# EAGLE schematic StaticPlatformMain_v1 (EAGLE 9.6.2)
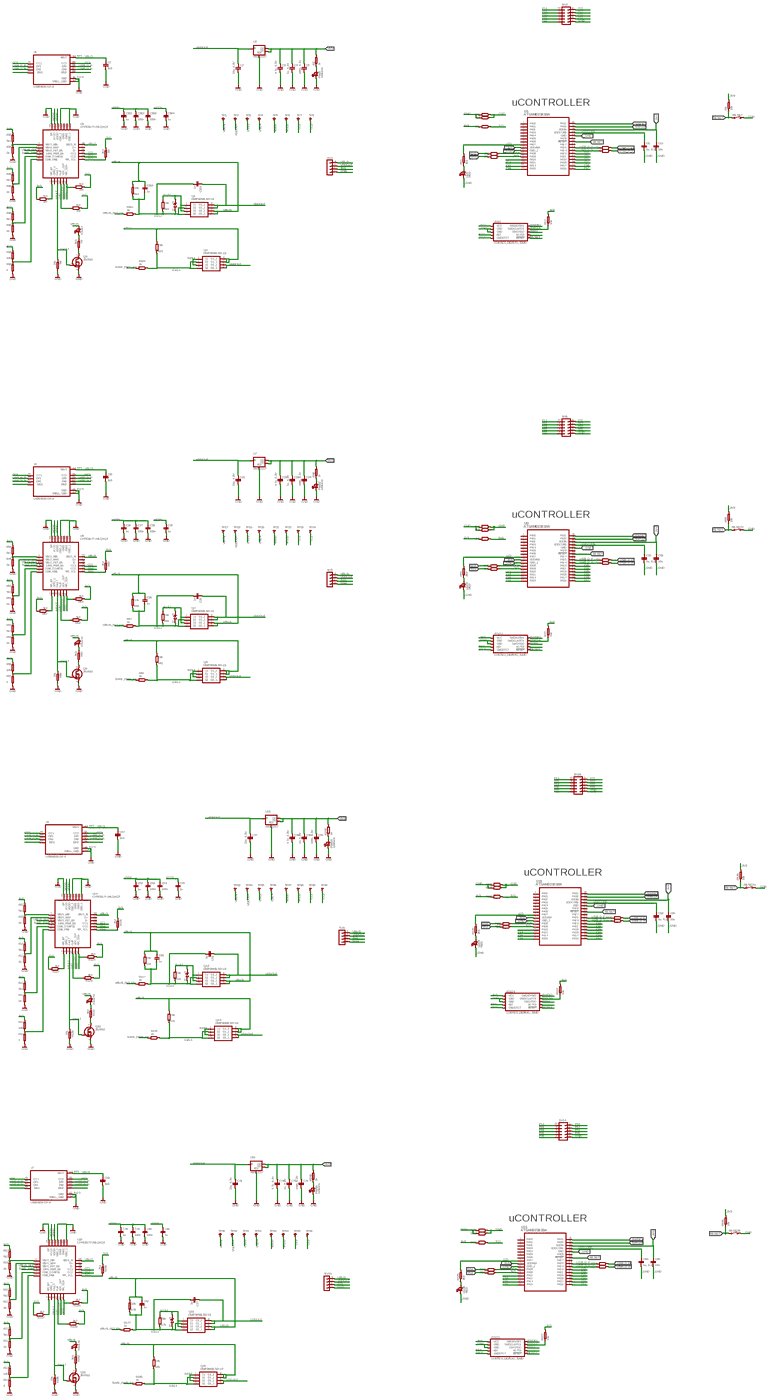
[diagram p0: schematic, sheet 1, overview]
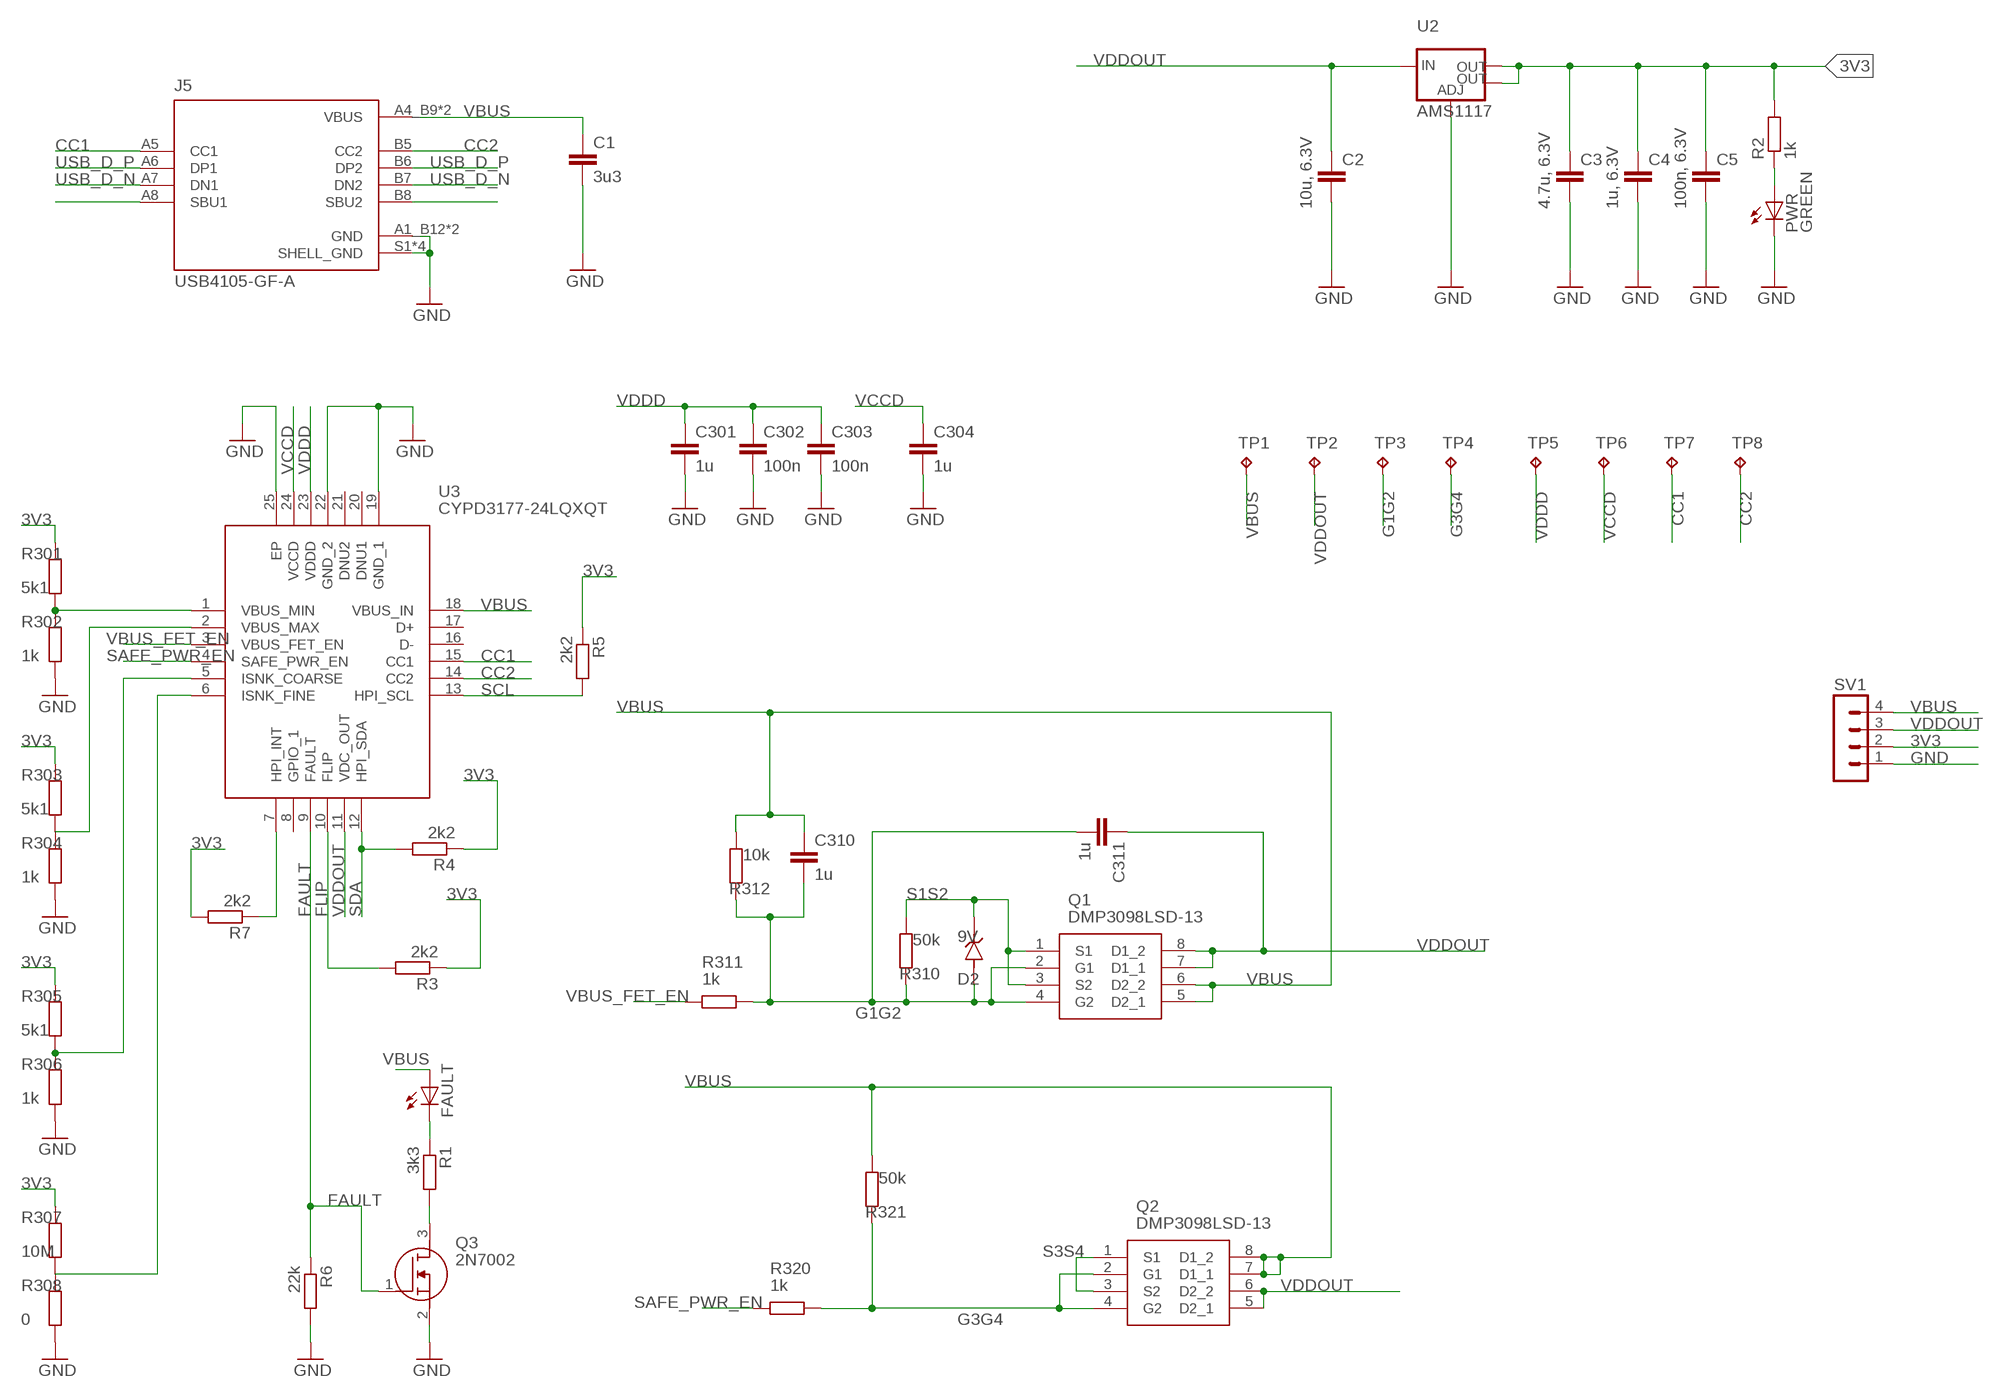
[diagram p1: schematic, sheet 1, part 1 of 6]
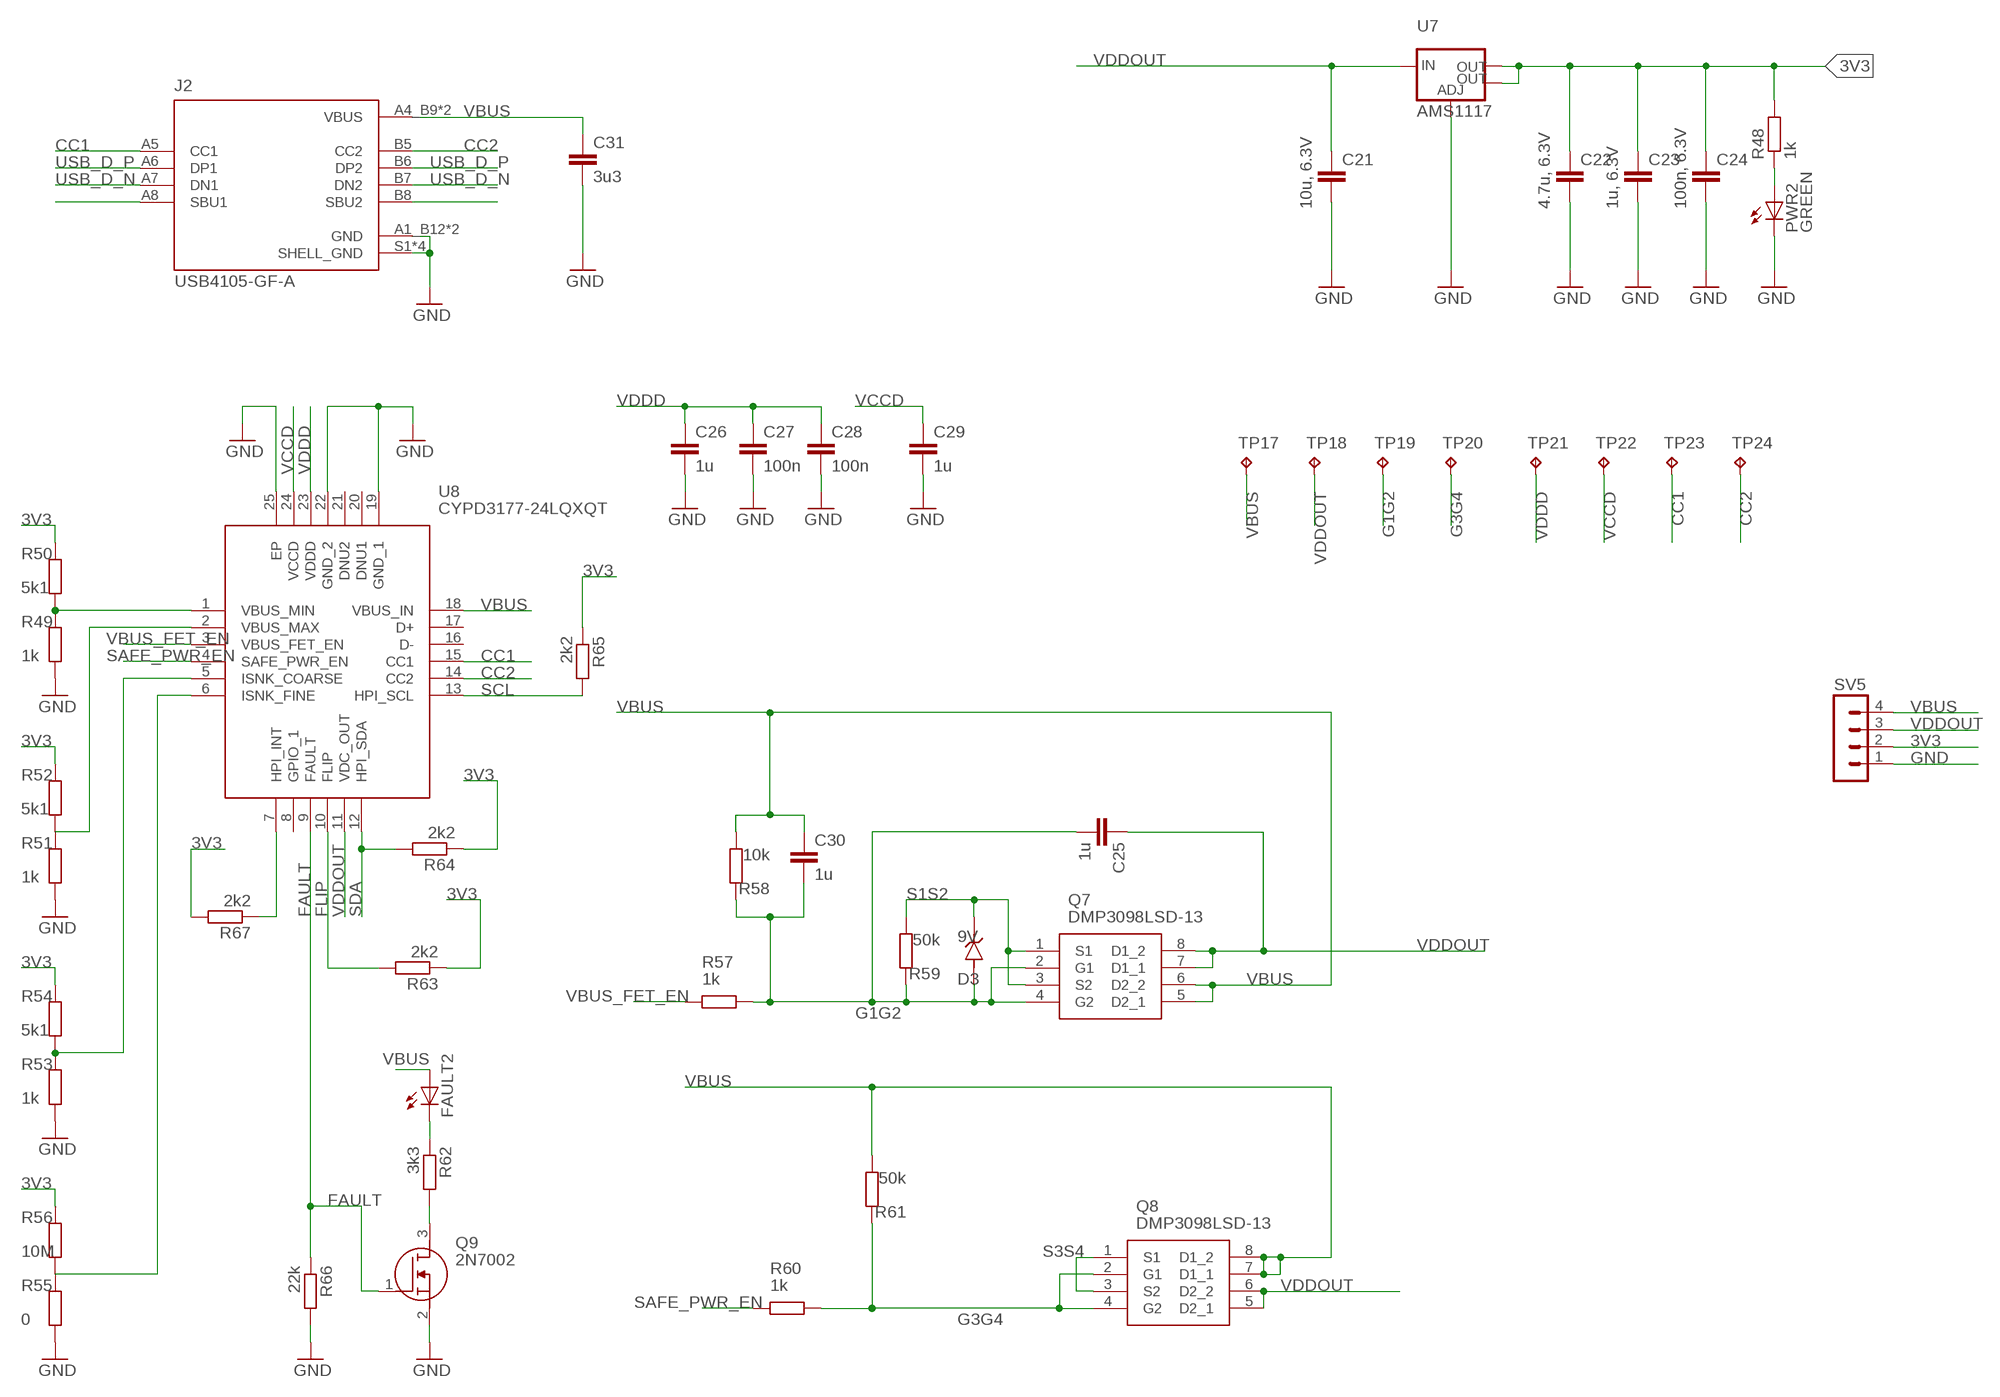
[diagram p2: schematic, sheet 1, part 2 of 6]
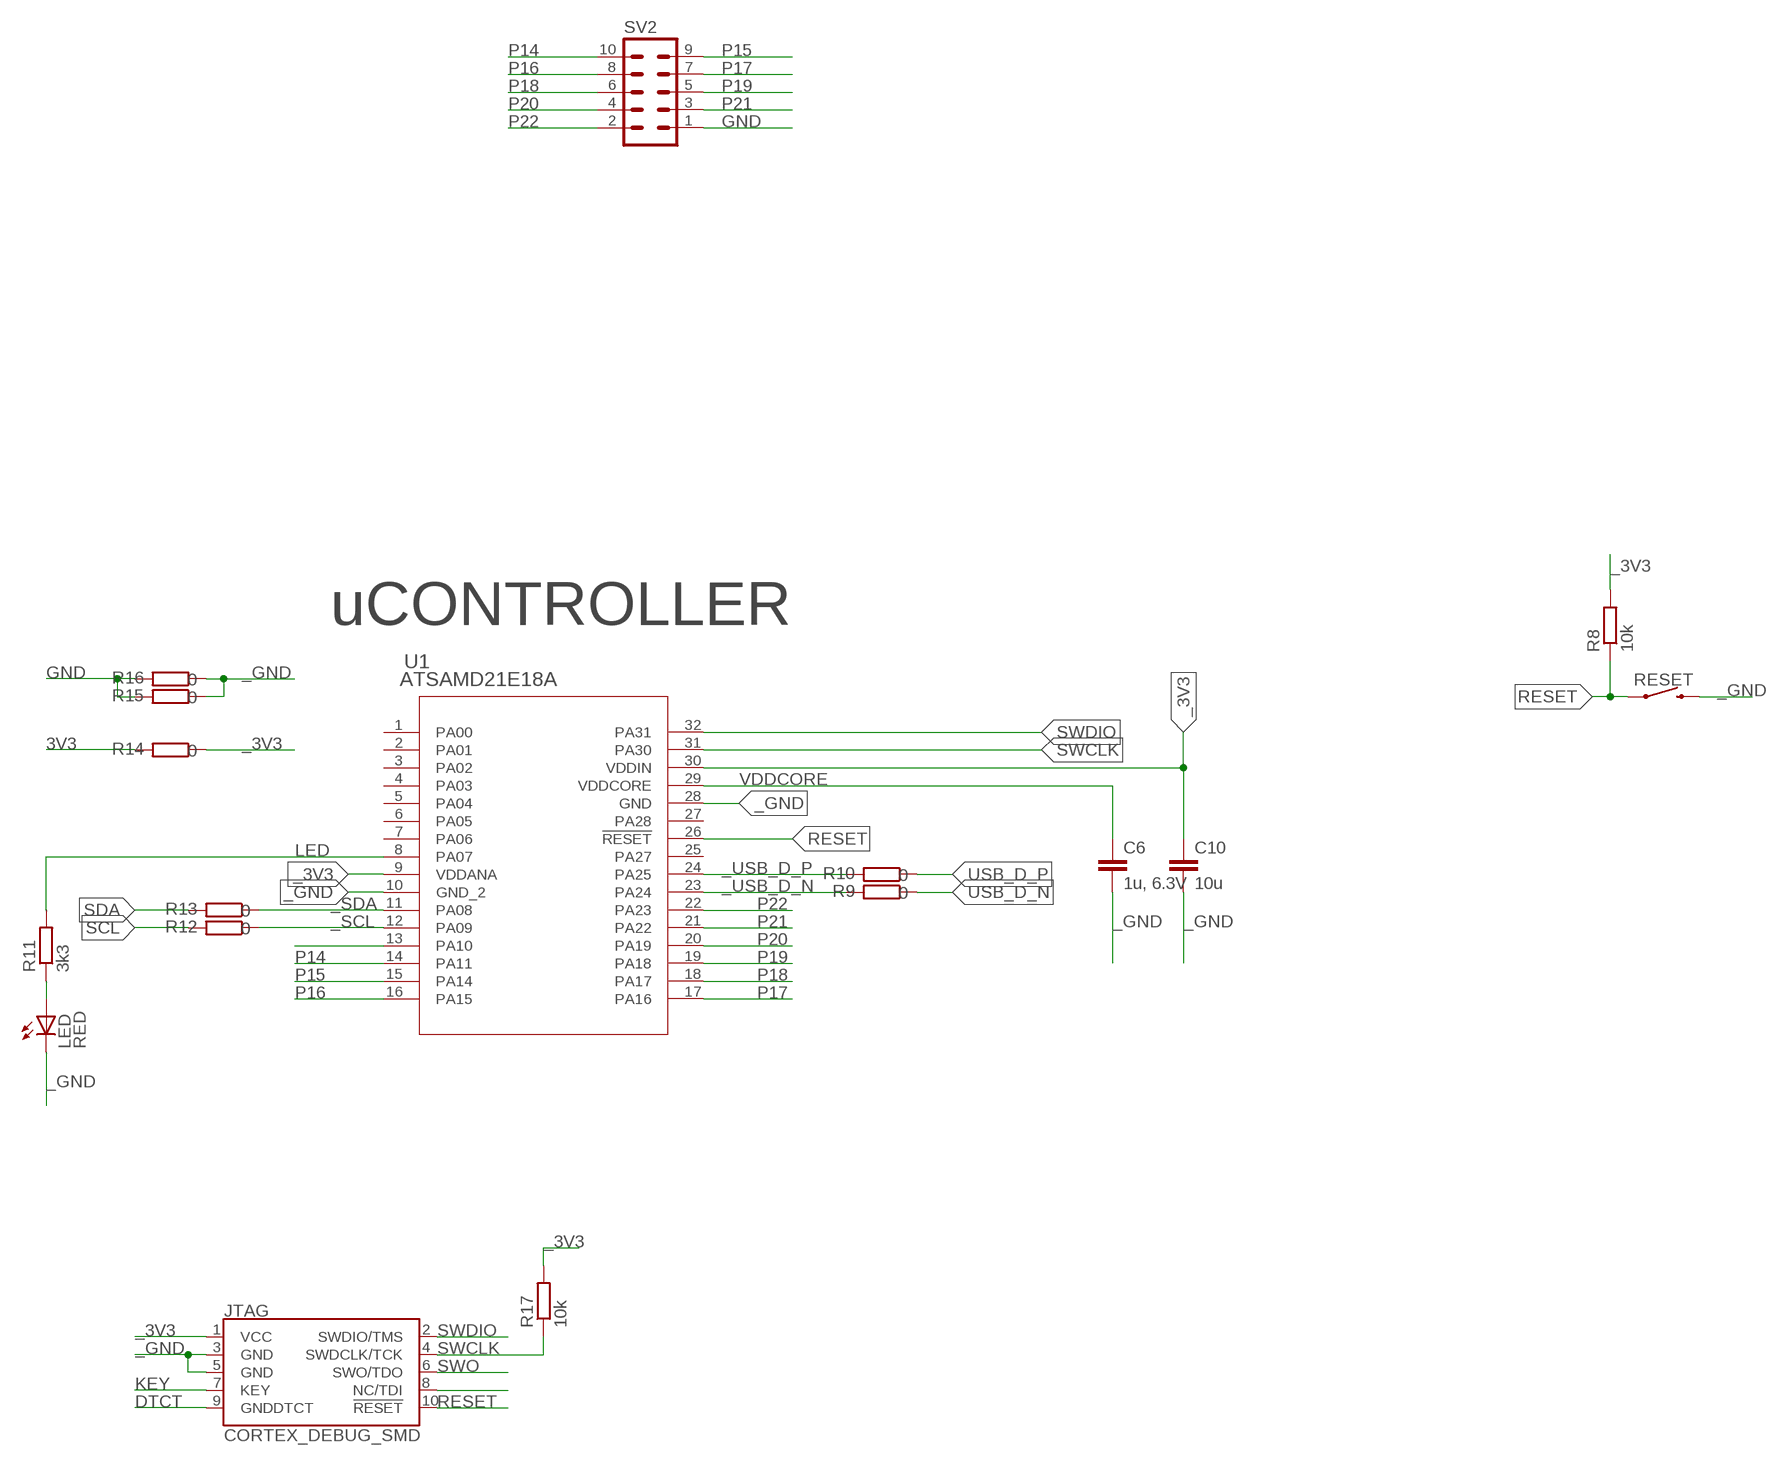
[diagram p3: schematic, sheet 1, part 3 of 6]
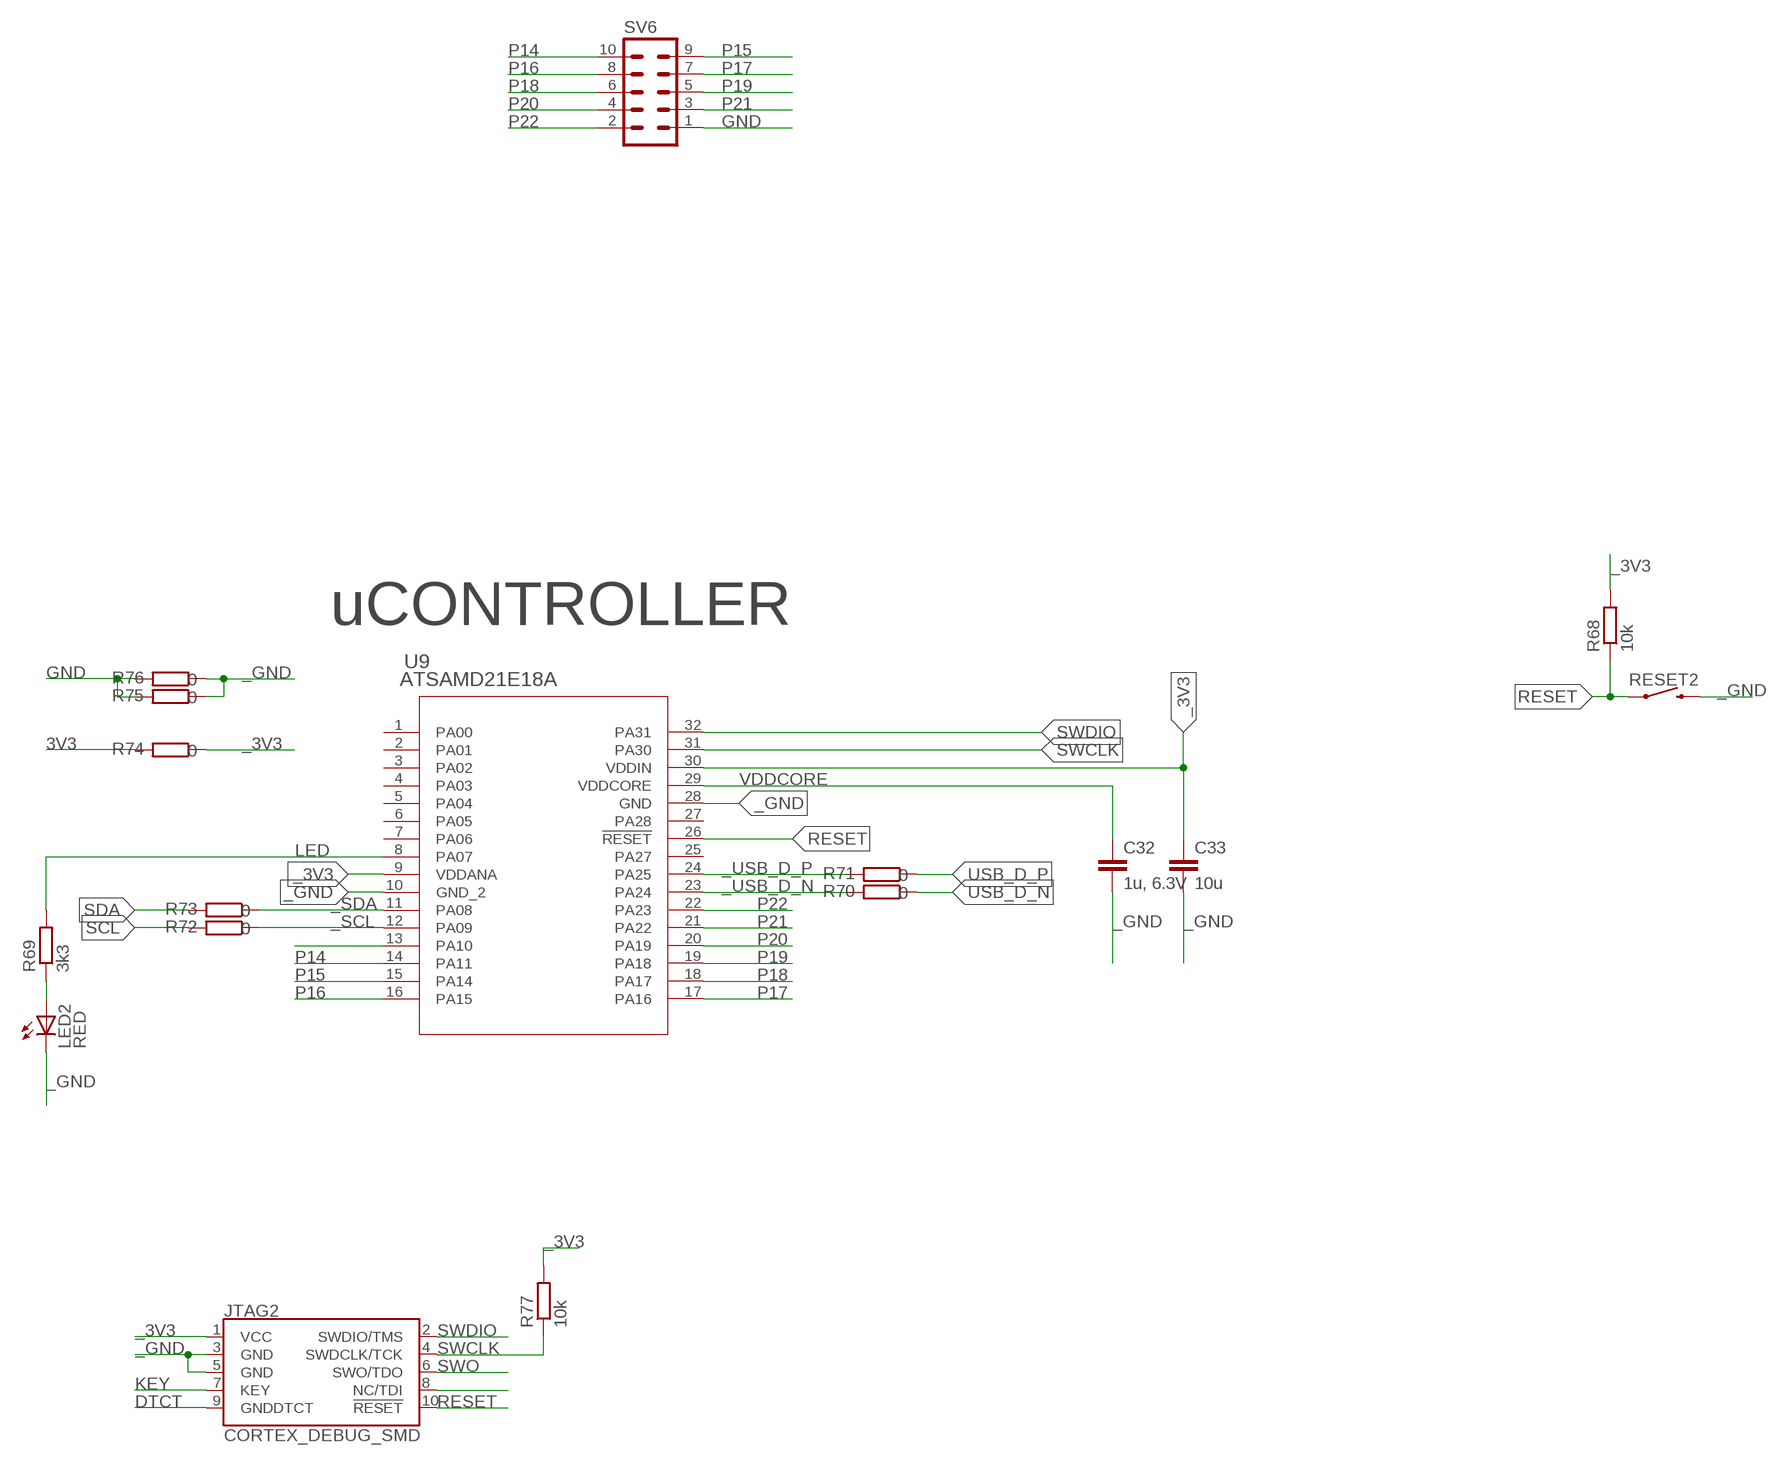
[diagram p4: schematic, sheet 1, part 4 of 6]
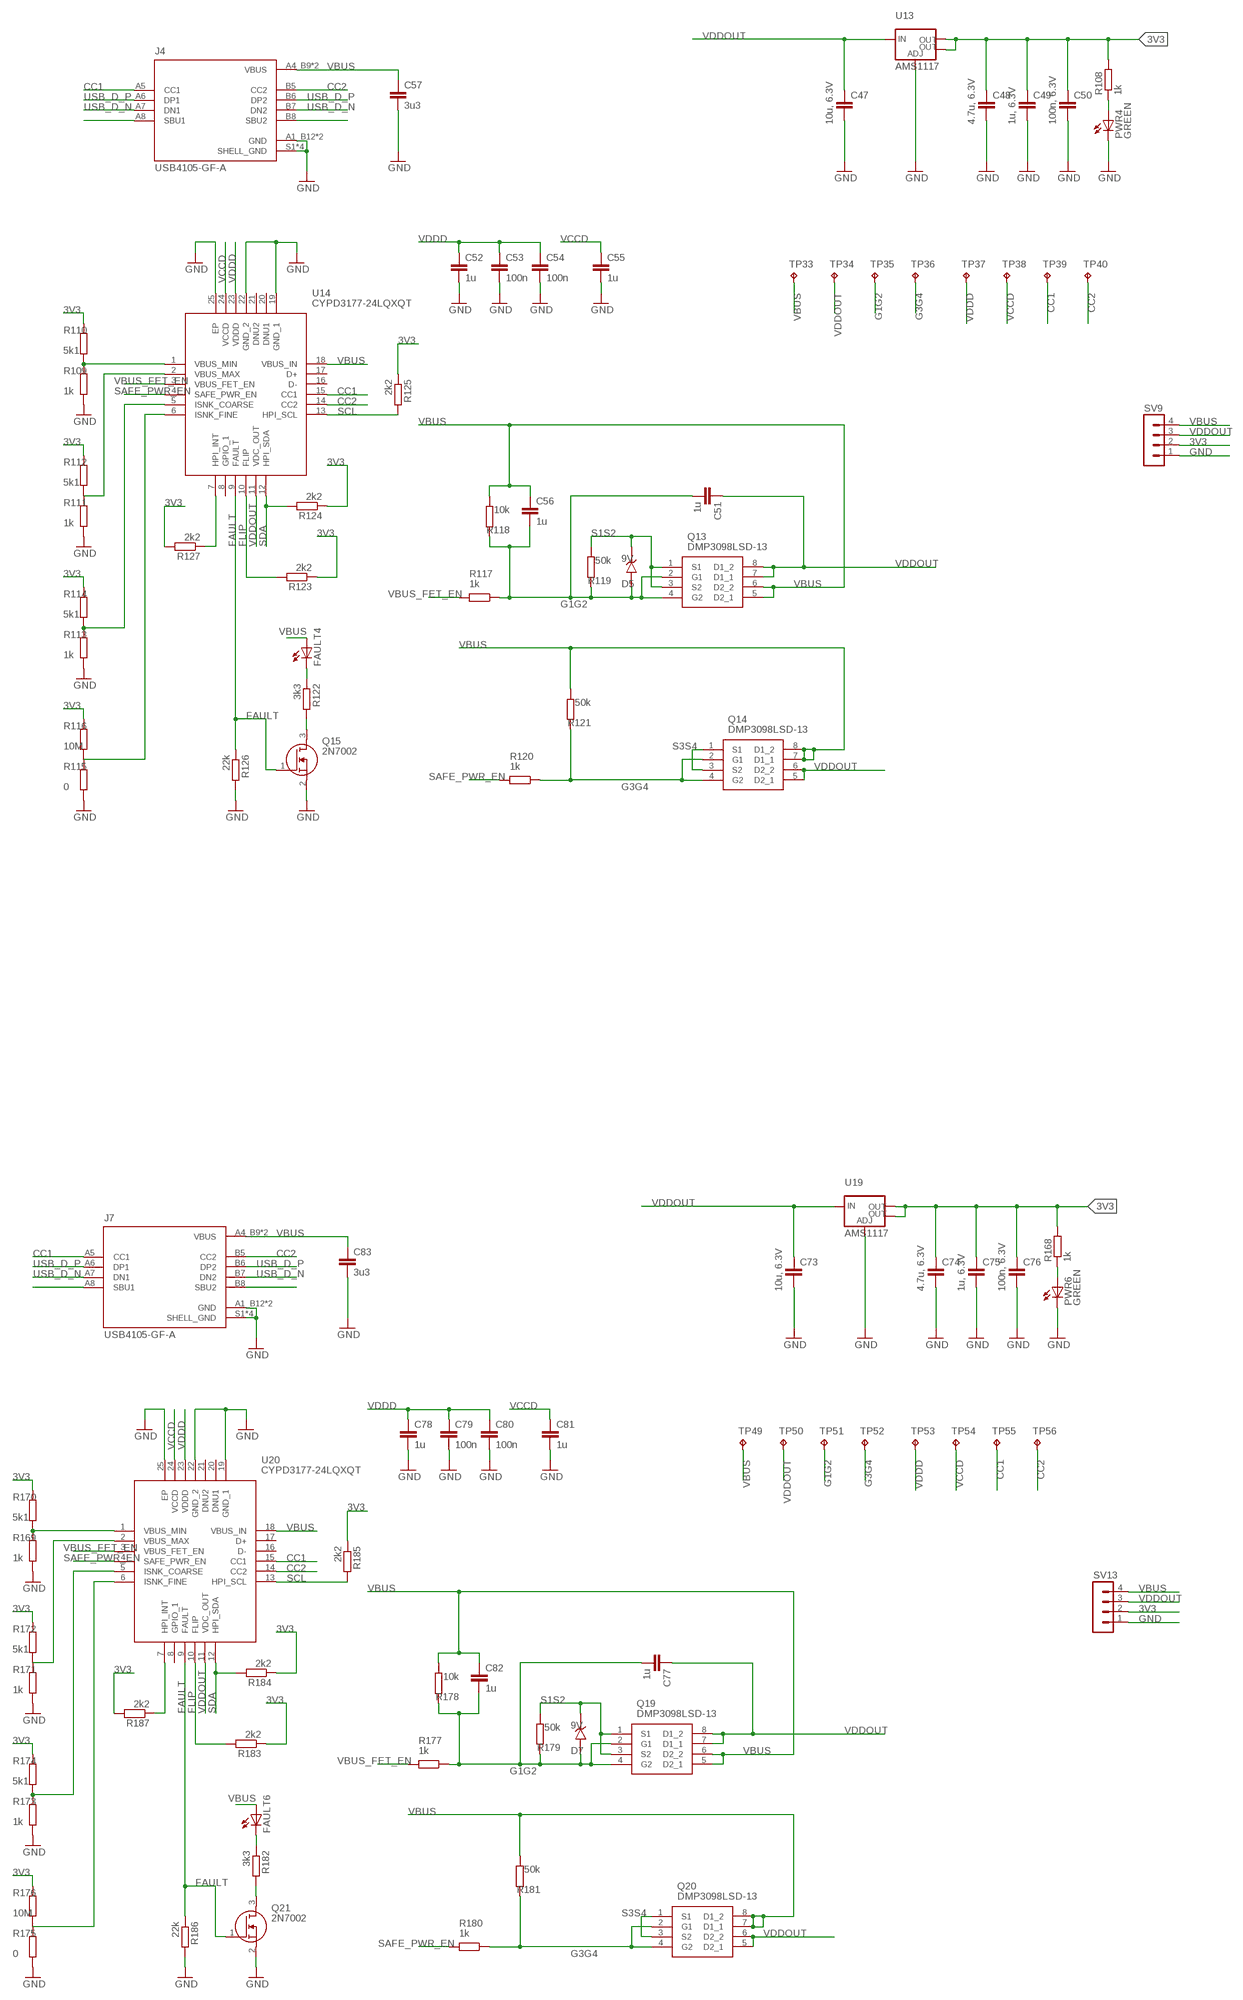
[diagram p5: schematic, sheet 1, part 5 of 6]
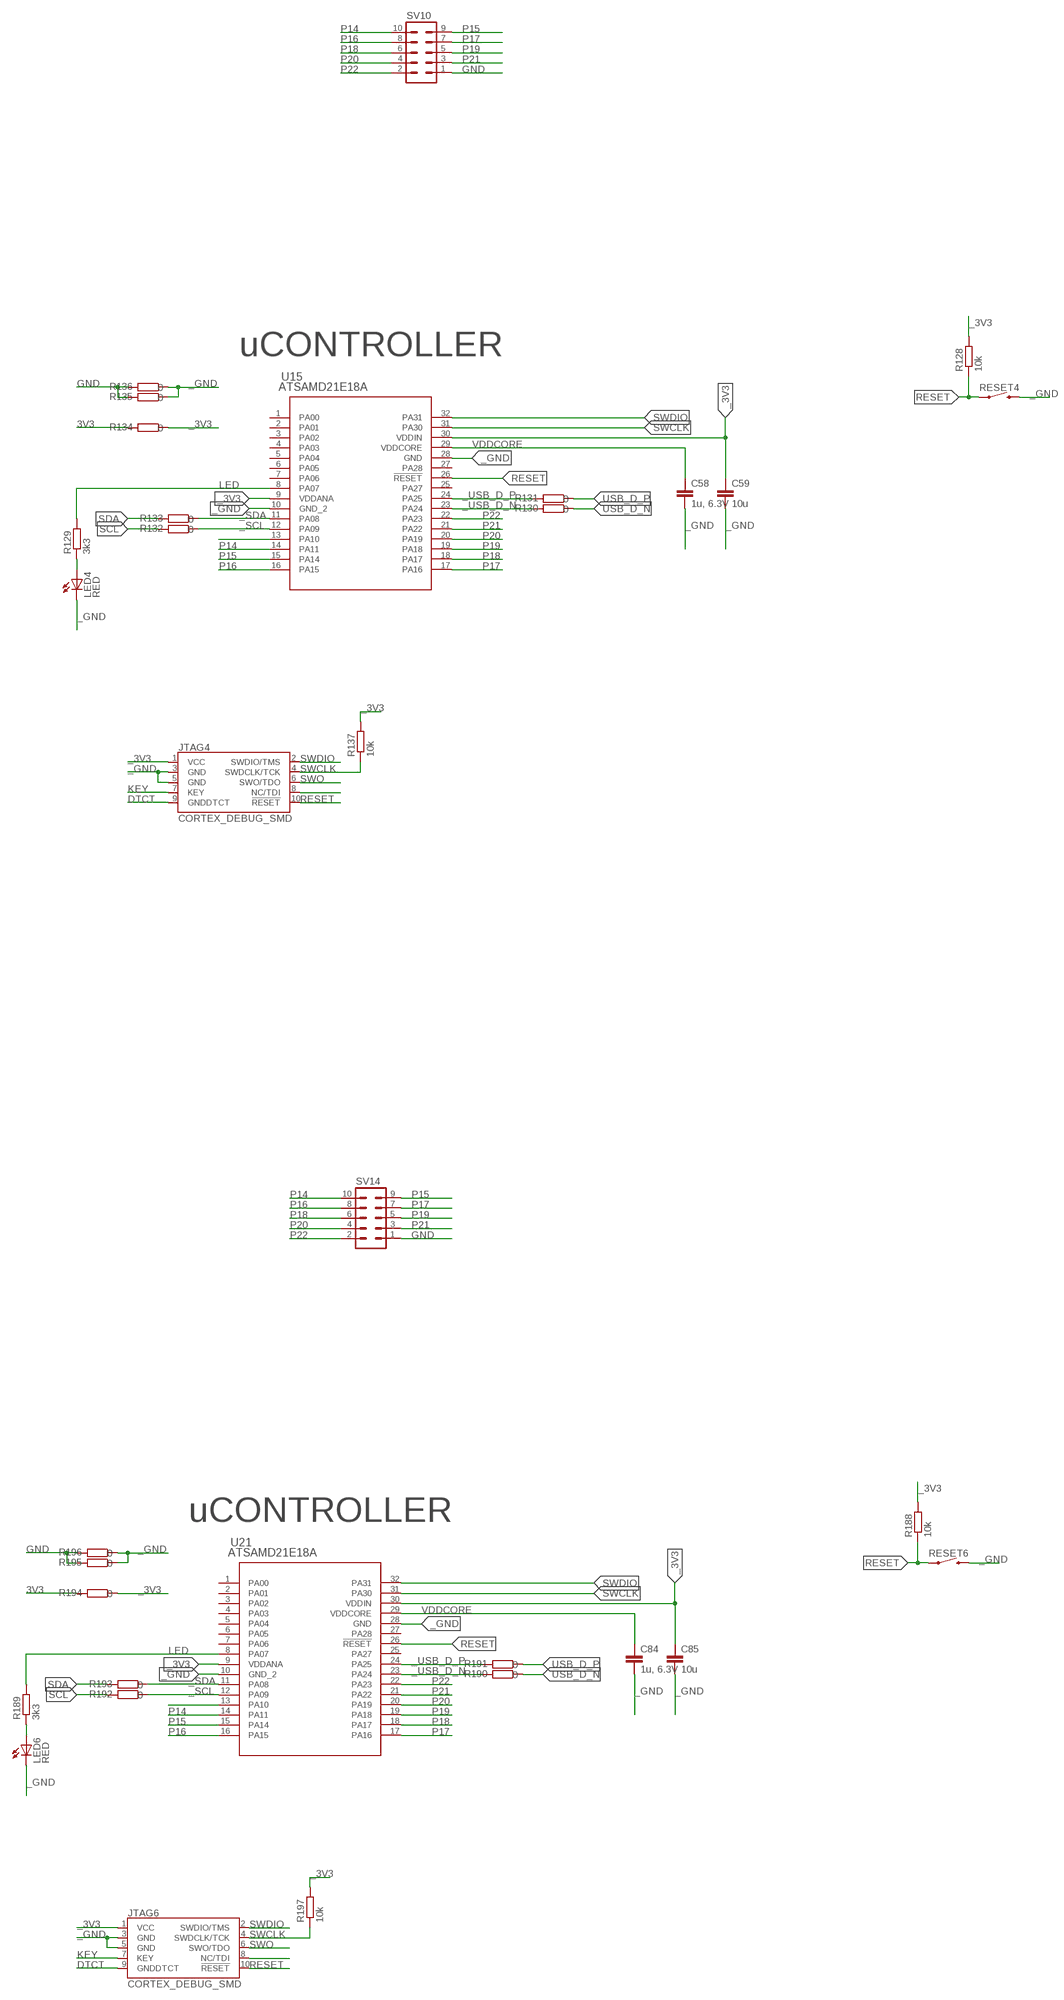
[diagram p6: schematic, sheet 1, part 6 of 6]

## Parts
C1  3u3  C-EUC0805K  [C0805K]
C2  10u, 6.3V  C-EUC0805K  [C0805K]
C3  4.7u, 6.3V  C-EUC0805K  [C0805K]
C4  1u, 6.3V  C-EUC0805K  [C0805K]
C5  100n, 6.3V  C-EUC0805K  [C0805K]
C6  1u, 6.3V  C-EUC0805  [C0805]
C10  10u  C-EUC0805  [C0805]
C21  10u, 6.3V  C-EUC0805K  [C0805K]
C22  4.7u, 6.3V  C-EUC0805K  [C0805K]
C23  1u, 6.3V  C-EUC0805K  [C0805K]
C24  100n, 6.3V  C-EUC0805K  [C0805K]
C25  1u  C-EUC0805K  [C0805K]
C26  1u  C-EUC0805K  [C0805K]
C27  100n  C-EUC0805K  [C0805K]
C28  100n  C-EUC0805K  [C0805K]
C29  1u  C-EUC0805K  [C0805K]
C30  1u  C-EUC0805K  [C0805K]
C31  3u3  C-EUC0805K  [C0805K]
C32  1u, 6.3V  C-EUC0805  [C0805]
C33  10u  C-EUC0805  [C0805]
C47  10u, 6.3V  C-EUC0805K  [C0805K]
C48  4.7u, 6.3V  C-EUC0805K  [C0805K]
C49  1u, 6.3V  C-EUC0805K  [C0805K]
C50  100n, 6.3V  C-EUC0805K  [C0805K]
C51  1u  C-EUC0805K  [C0805K]
C52  1u  C-EUC0805K  [C0805K]
C53  100n  C-EUC0805K  [C0805K]
C54  100n  C-EUC0805K  [C0805K]
C55  1u  C-EUC0805K  [C0805K]
C56  1u  C-EUC0805K  [C0805K]
C57  3u3  C-EUC0805K  [C0805K]
C58  1u, 6.3V  C-EUC0805  [C0805]
C59  10u  C-EUC0805  [C0805]
C73  10u, 6.3V  C-EUC0805K  [C0805K]
C74  4.7u, 6.3V  C-EUC0805K  [C0805K]
C75  1u, 6.3V  C-EUC0805K  [C0805K]
C76  100n, 6.3V  C-EUC0805K  [C0805K]
C77  1u  C-EUC0805K  [C0805K]
C78  1u  C-EUC0805K  [C0805K]
C79  100n  C-EUC0805K  [C0805K]
C80  100n  C-EUC0805K  [C0805K]
C81  1u  C-EUC0805K  [C0805K]
C82  1u  C-EUC0805K  [C0805K]
C83  3u3  C-EUC0805K  [C0805K]
C84  1u, 6.3V  C-EUC0805  [C0805]
C85  10u  C-EUC0805  [C0805]
C301  1u  C-EUC0805K  [C0805K]
C302  100n  C-EUC0805K  [C0805K]
C303  100n  C-EUC0805K  [C0805K]
C304  1u  C-EUC0805K  [C0805K]
C310  1u  C-EUC0805K  [C0805K]
C311  1u  C-EUC0805K  [C0805K]
D2  9V  BZV55C12_L0G  [DIOMELF3515N]
D3  9V  BZV55C12_L0G  [DIOMELF3515N]
D5  9V  BZV55C12_L0G  [DIOMELF3515N]
D7  9V  BZV55C12_L0G  [DIOMELF3515N]
FAULT  GREEN  LEDCHIPLED_0805  [CHIPLED_0805]
FAULT2  GREEN  LEDCHIPLED_0805  [CHIPLED_0805]
FAULT4  GREEN  LEDCHIPLED_0805  [CHIPLED_0805]
FAULT6  GREEN  LEDCHIPLED_0805  [CHIPLED_0805]
J2  USB4105-GF-A  [GCT_USB4105-GF-A]
J4  USB4105-GF-A  [GCT_USB4105-GF-A]
J5  USB4105-GF-A  [GCT_USB4105-GF-A]
J7  USB4105-GF-A  [GCT_USB4105-GF-A]
JTAG  CORTEX_DEBUG_SMD  [SAMTECH_FTSH-105-01]
JTAG2  CORTEX_DEBUG_SMD  [SAMTECH_FTSH-105-01]
JTAG4  CORTEX_DEBUG_SMD  [SAMTECH_FTSH-105-01]
JTAG6  CORTEX_DEBUG_SMD  [SAMTECH_FTSH-105-01]
LED  RED  LEDCHIPLED_0805  [CHIPLED_0805]
LED2  RED  LEDCHIPLED_0805  [CHIPLED_0805]
LED4  RED  LEDCHIPLED_0805  [CHIPLED_0805]
LED6  RED  LEDCHIPLED_0805  [CHIPLED_0805]
PWR  GREEN  LEDCHIPLED_0805  [CHIPLED_0805]
PWR2  GREEN  LEDCHIPLED_0805  [CHIPLED_0805]
PWR4  GREEN  LEDCHIPLED_0805  [CHIPLED_0805]
PWR6  GREEN  LEDCHIPLED_0805  [CHIPLED_0805]
Q1  DMP3098LSD-13  [SOIC127P600X175-8N]
Q2  DMP3098LSD-13  [SOIC127P600X175-8N]
Q3  2N7002  [SOT96P240X120-3N]
Q7  DMP3098LSD-13  [SOIC127P600X175-8N]
Q8  DMP3098LSD-13  [SOIC127P600X175-8N]
Q9  2N7002  [SOT96P240X120-3N]
Q13  DMP3098LSD-13  [SOIC127P600X175-8N]
Q14  DMP3098LSD-13  [SOIC127P600X175-8N]
Q15  2N7002  [SOT96P240X120-3N]
Q19  DMP3098LSD-13  [SOIC127P600X175-8N]
Q20  DMP3098LSD-13  [SOIC127P600X175-8N]
Q21  2N7002  [SOT96P240X120-3N]
R1  3k3  R-EU_R0805  [R0805]
R2  1k  R-EU_R0805  [R0805]
R3  2k2  R-EU_R0805  [R0805]
R4  2k2  R-EU_R0805  [R0805]
R5  2k2  R-EU_R0805  [R0805]
R6  22k  R-EU_R0805  [R0805]
R7  2k2  R-EU_R0805  [R0805]
R8  10k  R-EU_R0805  [R0805]
R9  0  R-EU_R0805  [R0805]
R10  0  R-EU_R0805  [R0805]
R11  3k3  R-EU_R0805  [R0805]
R12  0  R-EU_R0805  [R0805]
R13  0  R-EU_R0805  [R0805]
R14  0  R-EU_R0805  [R0805]
R15  0  R-EU_R0805  [R0805]
R16  0  R-EU_R0805  [R0805]
R17  10k  R-EU_R0805  [R0805]
R48  1k  R-EU_R0805  [R0805]
R49  1k  R-EU_R0805  [R0805]
R50  5k1  R-EU_R0805  [R0805]
R51  1k  R-EU_R0805  [R0805]
R52  5k1  R-EU_R0805  [R0805]
R53  1k  R-EU_R0805  [R0805]
R54  5k1  R-EU_R0805  [R0805]
R55  0  R-EU_R0805  [R0805]
R56  10M  R-EU_R0805  [R0805]
R57  1k  R-EU_R0805  [R0805]
R58  10k  R-EU_R0805  [R0805]
R59  50k  R-EU_R0805  [R0805]
R60  1k  R-EU_R0805  [R0805]
R61  50k  R-EU_R0805  [R0805]
R62  3k3  R-EU_R0805  [R0805]
R63  2k2  R-EU_R0805  [R0805]
R64  2k2  R-EU_R0805  [R0805]
R65  2k2  R-EU_R0805  [R0805]
R66  22k  R-EU_R0805  [R0805]
R67  2k2  R-EU_R0805  [R0805]
R68  10k  R-EU_R0805  [R0805]
R69  3k3  R-EU_R0805  [R0805]
R70  0  R-EU_R0805  [R0805]
R71  0  R-EU_R0805  [R0805]
R72  0  R-EU_R0805  [R0805]
R73  0  R-EU_R0805  [R0805]
R74  0  R-EU_R0805  [R0805]
R75  0  R-EU_R0805  [R0805]
R76  0  R-EU_R0805  [R0805]
R77  10k  R-EU_R0805  [R0805]
R108  1k  R-EU_R0805  [R0805]
R109  1k  R-EU_R0805  [R0805]
R110  5k1  R-EU_R0805  [R0805]
R111  1k  R-EU_R0805  [R0805]
R112  5k1  R-EU_R0805  [R0805]
R113  1k  R-EU_R0805  [R0805]
R114  5k1  R-EU_R0805  [R0805]
R115  0  R-EU_R0805  [R0805]
R116  10M  R-EU_R0805  [R0805]
R117  1k  R-EU_R0805  [R0805]
R118  10k  R-EU_R0805  [R0805]
R119  50k  R-EU_R0805  [R0805]
R120  1k  R-EU_R0805  [R0805]
R121  50k  R-EU_R0805  [R0805]
R122  3k3  R-EU_R0805  [R0805]
R123  2k2  R-EU_R0805  [R0805]
R124  2k2  R-EU_R0805  [R0805]
R125  2k2  R-EU_R0805  [R0805]
R126  22k  R-EU_R0805  [R0805]
R127  2k2  R-EU_R0805  [R0805]
R128  10k  R-EU_R0805  [R0805]
R129  3k3  R-EU_R0805  [R0805]
R130  0  R-EU_R0805  [R0805]
R131  0  R-EU_R0805  [R0805]
R132  0  R-EU_R0805  [R0805]
R133  0  R-EU_R0805  [R0805]
R134  0  R-EU_R0805  [R0805]
R135  0  R-EU_R0805  [R0805]
R136  0  R-EU_R0805  [R0805]
R137  10k  R-EU_R0805  [R0805]
R168  1k  R-EU_R0805  [R0805]
R169  1k  R-EU_R0805  [R0805]
R170  5k1  R-EU_R0805  [R0805]
R171  1k  R-EU_R0805  [R0805]
R172  5k1  R-EU_R0805  [R0805]
R173  1k  R-EU_R0805  [R0805]
R174  5k1  R-EU_R0805  [R0805]
R175  0  R-EU_R0805  [R0805]
R176  10M  R-EU_R0805  [R0805]
R177  1k  R-EU_R0805  [R0805]
R178  10k  R-EU_R0805  [R0805]
R179  50k  R-EU_R0805  [R0805]
R180  1k  R-EU_R0805  [R0805]
R181  50k  R-EU_R0805  [R0805]
R182  3k3  R-EU_R0805  [R0805]
R183  2k2  R-EU_R0805  [R0805]
R184  2k2  R-EU_R0805  [R0805]
R185  2k2  R-EU_R0805  [R0805]
R186  22k  R-EU_R0805  [R0805]
R187  2k2  R-EU_R0805  [R0805]
R188  10k  R-EU_R0805  [R0805]
R189  3k3  R-EU_R0805  [R0805]
R190  0  R-EU_R0805  [R0805]
R191  0  R-EU_R0805  [R0805]
R192  0  R-EU_R0805  [R0805]
R193  0  R-EU_R0805  [R0805]
R194  0  R-EU_R0805  [R0805]
R195  0  R-EU_R0805  [R0805]
R196  0  R-EU_R0805  [R0805]
R197  10k  R-EU_R0805  [R0805]
R301  5k1  R-EU_R0805  [R0805]
R302  1k  R-EU_R0805  [R0805]
R303  5k1  R-EU_R0805  [R0805]
R304  1k  R-EU_R0805  [R0805]
R305  5k1  R-EU_R0805  [R0805]
R306  1k  R-EU_R0805  [R0805]
R307  10M  R-EU_R0805  [R0805]
R308  0  R-EU_R0805  [R0805]
R310  50k  R-EU_R0805  [R0805]
R311  1k  R-EU_R0805  [R0805]
R312  10k  R-EU_R0805  [R0805]
R320  1k  R-EU_R0805  [R0805]
R321  50k  R-EU_R0805  [R0805]
RESET  MOMENTARY-SWITCH-SPST-SMD-6.0X3.5MM  [TACTILE_SWITCH_SMD_6.0X3.5MM]
RESET2  MOMENTARY-SWITCH-SPST-SMD-6.0X3.5MM  [TACTILE_SWITCH_SMD_6.0X3.5MM]
RESET4  MOMENTARY-SWITCH-SPST-SMD-6.0X3.5MM  [TACTILE_SWITCH_SMD_6.0X3.5MM]
RESET6  MOMENTARY-SWITCH-SPST-SMD-6.0X3.5MM  [TACTILE_SWITCH_SMD_6.0X3.5MM]
SV1  MA04-1  [MA04-1]
SV2  MA05-2  [MA05-2]
SV5  MA04-1  [MA04-1]
SV6  MA05-2  [MA05-2]
SV9  MA04-1  [MA04-1]
SV10  MA05-2  [MA05-2]
SV13  MA04-1  [MA04-1]
SV14  MA05-2  [MA05-2]
TP1  TPTP18R  [TP18R]
TP2  TPTP18R  [TP18R]
TP3  TPTP18R  [TP18R]
TP4  TPTP18R  [TP18R]
TP5  TPTP18R  [TP18R]
TP6  TPTP18R  [TP18R]
TP7  TPTP18R  [TP18R]
TP8  TPTP18R  [TP18R]
TP17  TPTP18R  [TP18R]
TP18  TPTP18R  [TP18R]
TP19  TPTP18R  [TP18R]
TP20  TPTP18R  [TP18R]
TP21  TPTP18R  [TP18R]
TP22  TPTP18R  [TP18R]
TP23  TPTP18R  [TP18R]
TP24  TPTP18R  [TP18R]
TP33  TPTP18R  [TP18R]
TP34  TPTP18R  [TP18R]
TP35  TPTP18R  [TP18R]
TP36  TPTP18R  [TP18R]
TP37  TPTP18R  [TP18R]
TP38  TPTP18R  [TP18R]
TP39  TPTP18R  [TP18R]
TP40  TPTP18R  [TP18R]
TP49  TPTP18R  [TP18R]
TP50  TPTP18R  [TP18R]
TP51  TPTP18R  [TP18R]
TP52  TPTP18R  [TP18R]
TP53  TPTP18R  [TP18R]
TP54  TPTP18R  [TP18R]
TP55  TPTP18R  [TP18R]
TP56  TPTP18R  [TP18R]
U1  ATSAMD21E18A  ATSAMD21E18A-AUTQFP32_MC_MCH-M  [TQFP32_MC_MCH-M]
U2  AMS1117  V_REG_LM1117SOT223  [SOT223]
U3  CYPD3177-24LQXQT  [QFN50P400X400X60-25N]
U7  AMS1117  V_REG_LM1117SOT223  [SOT223]
U8  CYPD3177-24LQXQT  [QFN50P400X400X60-25N]
U9  ATSAMD21E18A  ATSAMD21E18A-AUTQFP32_MC_MCH-M  [TQFP32_MC_MCH-M]
U13  AMS1117  V_REG_LM1117SOT223  [SOT223]
U14  CYPD3177-24LQXQT  [QFN50P400X400X60-25N]
U15  ATSAMD21E18A  ATSAMD21E18A-AUTQFP32_MC_MCH-M  [TQFP32_MC_MCH-M]
U19  AMS1117  V_REG_LM1117SOT223  [SOT223]
U20  CYPD3177-24LQXQT  [QFN50P400X400X60-25N]
U21  ATSAMD21E18A  ATSAMD21E18A-AUTQFP32_MC_MCH-M  [TQFP32_MC_MCH-M]

## Nets
3V3: C3.1 C4.1 C5.1 C22.1 C23.1 C24.1 C48.1 C49.1 C50.1 C74.1 C75.1 C76.1 R2.2 R3.1 R4.1 R5.1 R7.2 R14.2 R48.2 R50.2 R52.2 R54.2 R56.2 R63.1 R64.1 R65.1 R67.2 R74.2 R108.2 R110.2 R112.2 R114.2 R116.2 R123.1 R124.1 R125.1 R127.2 R134.2 R168.2 R170.2 R172.2 R174.2 R176.2 R183.1 R184.1 R185.1 R187.2 R194.2 R301.2 R303.2 R305.2 R307.2 SV1.2 SV5.2 SV9.2 SV13.2 U2.2(OUT) U2.4(OUT) U7.2(OUT) U7.4(OUT) U13.2(OUT) U13.4(OUT) U19.2(OUT) U19.4(OUT)
_3V3: C10.1 C33.1 C59.1 C85.1 JTAG2.1(VCC) JTAG4.1(VCC) JTAG6.1(VCC) JTAG.1(VCC) R8.2 R14.1 R17.2 R68.2 R74.1 R77.2 R128.2 R134.1 R137.2 R188.2 R194.1 R197.2 U1.9(VDDANA) U1.30(VDDIN) U9.9(VDDANA) U9.30(VDDIN) U15.9(VDDANA) U15.30(VDDIN) U21.9(VDDANA) U21.30(VDDIN)
_GND: C6.2 C10.2 C32.2 C33.2 C58.2 C59.2 C84.2 C85.2 JTAG2.3(GND) JTAG2.5(GND) JTAG4.3(GND) JTAG4.5(GND) JTAG6.3(GND) JTAG6.5(GND) JTAG.3(GND) JTAG.5(GND) LED2.C LED4.C LED6.C LED.C R15.1 R16.1 R75.1 R76.1 R135.1 R136.1 R195.1 R196.1 RESET2.2 RESET4.2 RESET6.2 RESET.2 U1.10(GND_2) U1.28(GND) U9.10(GND_2) U9.28(GND) U15.10(GND_2) U15.28(GND) U21.10(GND_2) U21.28(GND)
_SCL: R12.1 R72.1 R132.1 R192.1 U1.12(PA09) U9.12(PA09) U15.12(PA09) U21.12(PA09)
_SDA: R13.1 R73.1 R133.1 R193.1 U1.11(PA08) U9.11(PA08) U15.11(PA08) U21.11(PA08)
_USB_D_N [usbpair]: R9.2 R70.2 R130.2 R190.2 U1.23(PA24) U9.23(PA24) U15.23(PA24) U21.23(PA24)
_USB_D_P [usbpair]: R10.2 R71.2 R131.2 R191.2 U1.24(PA25) U9.24(PA25) U15.24(PA25) U21.24(PA25)
CC1: J2.A5(CC1) J4.A5(CC1) J5.A5(CC1) J7.A5(CC1) TP7.TP TP23.TP TP39.TP TP55.TP U3.15(CC1) U8.15(CC1) U14.15(CC1) U20.15(CC1)
CC2: J2.B5(CC2) J4.B5(CC2) J5.B5(CC2) J7.B5(CC2) TP8.TP TP24.TP TP40.TP TP56.TP U3.14(CC2) U8.14(CC2) U14.14(CC2) U20.14(CC2)
DTCT: JTAG2.9(GNDDTCT) JTAG4.9(GNDDTCT) JTAG6.9(GNDDTCT) JTAG.9(GNDDTCT)
FAULT: Q3.1(G) Q9.1(G) Q15.1(G) Q21.1(G) R6.1 R66.1 R126.1 R186.1 U3.9(FAULT) U8.9(FAULT) U14.9(FAULT) U20.9(FAULT)
FLIP: R3.2 R63.2 R123.2 R183.2 U3.10(FLIP) U8.10(FLIP) U14.10(FLIP) U20.10(FLIP)
G1G2: C25.2 C30.2 C51.2 C56.2 C77.2 C82.2 C310.2 C311.2 D2.A D3.A D5.A D7.A Q1.2(G1) Q1.4(G2) Q7.2(G1) Q7.4(G2) Q13.2(G1) Q13.4(G2) Q19.2(G1) Q19.4(G2) R57.1 R58.2 R59.2 R117.1 R118.2 R119.2 R177.1 R178.2 R179.2 R310.2 R311.1 R312.2 TP3.TP TP19.TP TP35.TP TP51.TP
G3G4: Q2.2(G1) Q2.4(G2) Q8.2(G1) Q8.4(G2) Q14.2(G1) Q14.4(G2) Q20.2(G1) Q20.4(G2) R60.1 R61.2 R120.1 R121.2 R180.1 R181.2 R320.1 R321.2 TP4.TP TP20.TP TP36.TP TP52.TP
GND: C1.2 C2.2 C3.2 C4.2 C5.2 C21.2 C22.2 C23.2 C24.2 C26.2 C27.2 C28.2 C29.2 C31.2 C47.2 C48.2 C49.2 C50.2 C52.2 C53.2 C54.2 C55.2 C57.2 C73.2 C74.2 C75.2 C76.2 C78.2 C79.2 C80.2 C81.2 C83.2 C301.2 C302.2 C303.2 C304.2 J2.A1_B12(GND) J2.B1_A12(GND) J2.S1(SHELL_GND) J2.S2(SHELL_GND) J2.S3(SHELL_GND) J2.S4(SHELL_GND) J4.A1_B12(GND) J4.B1_A12(GND) J4.S1(SHELL_GND) J4.S2(SHELL_GND) J4.S3(SHELL_GND) J4.S4(SHELL_GND) J5.A1_B12(GND) J5.B1_A12(GND) J5.S1(SHELL_GND) J5.S2(SHELL_GND) J5.S3(SHELL_GND) J5.S4(SHELL_GND) J7.A1_B12(GND) J7.B1_A12(GND) J7.S1(SHELL_GND) J7.S2(SHELL_GND) J7.S3(SHELL_GND) J7.S4(SHELL_GND) PWR2.C PWR4.C PWR6.C PWR.C Q3.2(S) Q9.2(S) Q15.2(S) Q21.2(S) R6.2 R15.2 R16.2 R49.1 R51.1 R53.1 R55.1 R66.2 R75.2 R76.2 R109.1 R111.1 R113.1 R115.1 R126.2 R135.2 R136.2 R169.1 R171.1 R173.1 R175.1 R186.2 R195.2 R196.2 R302.1 R304.1 R306.1 R308.1 SV1.1 SV2.1 SV5.1 SV6.1 SV9.1 SV10.1 SV13.1 SV14.1 U2.1(ADJ) U3.19(GND_1) U3.22(GND_2) U3.25(EP) U7.1(ADJ) U8.19(GND_1) U8.22(GND_2) U8.25(EP) U13.1(ADJ) U14.19(GND_1) U14.22(GND_2) U14.25(EP) U19.1(ADJ) U20.19(GND_1) U20.22(GND_2) U20.25(EP)
KEY: JTAG2.7(KEY) JTAG4.7(KEY) JTAG6.7(KEY) JTAG.7(KEY)
LED: R11.2 R69.2 R129.2 R189.2 U1.8(PA07) U9.8(PA07) U15.8(PA07) U21.8(PA07)
LED_GP: LED.A R11.1
LED_GP2: LED2.A R69.1
LED_GP4: LED4.A R129.1
LED_GP6: LED6.A R189.1
LED_PWR: PWR.A R2.1
LED_PWR2: PWR2.A R48.1
LED_PWR4: PWR4.A R108.1
LED_PWR6: PWR6.A R168.1
N$1: FAULT.C R1.1
N$2: R7.1 U3.7(HPI_INT)
N$3: R301.1 R302.2 U3.1(VBUS_MIN)
N$4: R303.1 R304.2 U3.2(VBUS_MAX)
N$5: R305.1 R306.2 U3.5(ISNK_COARSE)
N$7: Q3.3(D) R1.2
N$9: J5.A8(SBU1)
N$10: R307.1 R308.2 U3.6(ISNK_FINE)
N$19: J5.B8(SBU2)
N$24: JTAG.8(NC/TDI)
N$28: U1.13(PA10)
N$87: J2.A8(SBU1)
N$88: J2.B8(SBU2)
N$89: R49.2 R50.1 U8.1(VBUS_MIN)
N$90: R51.2 R52.1 U8.2(VBUS_MAX)
N$91: R53.2 R54.1 U8.5(ISNK_COARSE)
N$92: R55.2 R56.1 U8.6(ISNK_FINE)
N$93: FAULT2.C R62.1
N$94: Q9.3(D) R62.2
N$95: R67.1 U8.7(HPI_INT)
N$96: JTAG2.8(NC/TDI)
N$97: U9.13(PA10)
N$173: J4.A8(SBU1)
N$174: J4.B8(SBU2)
N$175: R109.2 R110.1 U14.1(VBUS_MIN)
N$176: R111.2 R112.1 U14.2(VBUS_MAX)
N$177: R113.2 R114.1 U14.5(ISNK_COARSE)
N$178: R115.2 R116.1 U14.6(ISNK_FINE)
N$179: FAULT4.C R122.1
N$180: Q15.3(D) R122.2
N$181: R127.1 U14.7(HPI_INT)
N$182: JTAG4.8(NC/TDI)
N$183: U15.13(PA10)
N$259: J7.A8(SBU1)
N$260: J7.B8(SBU2)
N$261: R169.2 R170.1 U20.1(VBUS_MIN)
N$262: R171.2 R172.1 U20.2(VBUS_MAX)
N$263: R173.2 R174.1 U20.5(ISNK_COARSE)
N$264: R175.2 R176.1 U20.6(ISNK_FINE)
N$265: FAULT6.C R182.1
N$266: Q21.3(D) R182.2
N$267: R187.1 U20.7(HPI_INT)
N$268: JTAG6.8(NC/TDI)
N$269: U21.13(PA10)
P14: SV2.10 SV6.10 SV10.10 SV14.10 U1.14(PA11) U9.14(PA11) U15.14(PA11) U21.14(PA11)
P15: SV2.9 SV6.9 SV10.9 SV14.9 U1.15(PA14) U9.15(PA14) U15.15(PA14) U21.15(PA14)
P16: SV2.8 SV6.8 SV10.8 SV14.8 U1.16(PA15) U9.16(PA15) U15.16(PA15) U21.16(PA15)
P17: SV2.7 SV6.7 SV10.7 SV14.7 U1.17(PA16) U9.17(PA16) U15.17(PA16) U21.17(PA16)
P18: SV2.6 SV6.6 SV10.6 SV14.6 U1.18(PA17) U9.18(PA17) U15.18(PA17) U21.18(PA17)
P19: SV2.5 SV6.5 SV10.5 SV14.5 U1.19(PA18) U9.19(PA18) U15.19(PA18) U21.19(PA18)
P20: SV2.4 SV6.4 SV10.4 SV14.4 U1.20(PA19) U9.20(PA19) U15.20(PA19) U21.20(PA19)
P21: SV2.3 SV6.3 SV10.3 SV14.3 U1.21(PA22) U9.21(PA22) U15.21(PA22) U21.21(PA22)
P22: SV2.2 SV6.2 SV10.2 SV14.2 U1.22(PA23) U9.22(PA23) U15.22(PA23) U21.22(PA23)
RESET: JTAG2.10(!RESET) JTAG4.10(!RESET) JTAG6.10(!RESET) JTAG.10(!RESET) R8.1 R68.1 R128.1 R188.1 RESET2.1 RESET4.1 RESET6.1 RESET.1 U1.26(!RESET) U9.26(!RESET) U15.26(!RESET) U21.26(!RESET)
S1S2: D2.C(K) D3.C(K) D5.C(K) D7.C(K) Q1.1(S1) Q1.3(S2) Q7.1(S1) Q7.3(S2) Q13.1(S1) Q13.3(S2) Q19.1(S1) Q19.3(S2) R59.1 R119.1 R179.1 R310.1
S3S4: Q2.1(S1) Q2.3(S2) Q8.1(S1) Q8.3(S2) Q14.1(S1) Q14.3(S2) Q20.1(S1) Q20.3(S2)
SAFE_PWR_EN: R60.2 R120.2 R180.2 R320.2 U3.4(SAFE_PWR_EN) U8.4(SAFE_PWR_EN) U14.4(SAFE_PWR_EN) U20.4(SAFE_PWR_EN)
SCL: R5.2 R12.2 R65.2 R72.2 R125.2 R132.2 R185.2 R192.2 U3.13(HPI_SCL) U8.13(HPI_SCL) U14.13(HPI_SCL) U20.13(HPI_SCL)
SDA: R4.2 R13.2 R64.2 R73.2 R124.2 R133.2 R184.2 R193.2 U3.12(HPI_SDA) U8.12(HPI_SDA) U14.12(HPI_SDA) U20.12(HPI_SDA)
SWCLK: JTAG2.4(SWDCLK/TCK) JTAG4.4(SWDCLK/TCK) JTAG6.4(SWDCLK/TCK) JTAG.4(SWDCLK/TCK) R17.1 R77.1 R137.1 R197.1 U1.31(PA30) U9.31(PA30) U15.31(PA30) U21.31(PA30)
SWDIO: JTAG2.2(SWDIO/TMS) JTAG4.2(SWDIO/TMS) JTAG6.2(SWDIO/TMS) JTAG.2(SWDIO/TMS) U1.32(PA31) U9.32(PA31) U15.32(PA31) U21.32(PA31)
SWO: JTAG2.6(SWO/TDO) JTAG4.6(SWO/TDO) JTAG6.6(SWO/TDO) JTAG.6(SWO/TDO)
USB_D_N [usbpair]: J2.A7(DN1) J2.B7(DN2) J4.A7(DN1) J4.B7(DN2) J5.A7(DN1) J5.B7(DN2) J7.A7(DN1) J7.B7(DN2) R9.1 R70.1 R130.1 R190.1
USB_D_P [usbpair]: J2.A6(DP1) J2.B6(DP2) J4.A6(DP1) J4.B6(DP2) J5.A6(DP1) J5.B6(DP2) J7.A6(DP1) J7.B6(DP2) R10.1 R71.1 R131.1 R191.1
VBUS: C1.1 C30.1 C31.1 C56.1 C57.1 C82.1 C83.1 C310.1 FAULT2.A FAULT4.A FAULT6.A FAULT.A J2.A4_B9(VBUS) J2.B4_A9(VBUS) J4.A4_B9(VBUS) J4.B4_A9(VBUS) J5.A4_B9(VBUS) J5.B4_A9(VBUS) J7.A4_B9(VBUS) J7.B4_A9(VBUS) Q1.5(D2_1) Q1.6(D2_2) Q2.7(D1_1) Q2.8(D1_2) Q7.5(D2_1) Q7.6(D2_2) Q8.7(D1_1) Q8.8(D1_2) Q13.5(D2_1) Q13.6(D2_2) Q14.7(D1_1) Q14.8(D1_2) Q19.5(D2_1) Q19.6(D2_2) Q20.7(D1_1) Q20.8(D1_2) R58.1 R61.1 R118.1 R121.1 R178.1 R181.1 R312.1 R321.1 SV1.4 SV5.4 SV9.4 SV13.4 TP1.TP TP17.TP TP33.TP TP49.TP U3.18(VBUS_IN) U8.18(VBUS_IN) U14.18(VBUS_IN) U20.18(VBUS_IN)
VBUS_FET_EN: R57.2 R117.2 R177.2 R311.2 U3.3(VBUS_FET_EN) U8.3(VBUS_FET_EN) U14.3(VBUS_FET_EN) U20.3(VBUS_FET_EN)
VCCD: C29.1 C55.1 C81.1 C304.1 TP6.TP TP22.TP TP38.TP TP54.TP U3.24(VCCD) U8.24(VCCD) U14.24(VCCD) U20.24(VCCD)
VDDCORE: C6.1 C32.1 C58.1 C84.1 U1.29(VDDCORE) U9.29(VDDCORE) U15.29(VDDCORE) U21.29(VDDCORE)
VDDD: C26.1 C27.1 C28.1 C52.1 C53.1 C54.1 C78.1 C79.1 C80.1 C301.1 C302.1 C303.1 TP5.TP TP21.TP TP37.TP TP53.TP U3.23(VDDD) U8.23(VDDD) U14.23(VDDD) U20.23(VDDD)
VDDOUT: C2.1 C21.1 C25.1 C47.1 C51.1 C73.1 C77.1 C311.1 Q1.7(D1_1) Q1.8(D1_2) Q2.5(D2_1) Q2.6(D2_2) Q7.7(D1_1) Q7.8(D1_2) Q8.5(D2_1) Q8.6(D2_2) Q13.7(D1_1) Q13.8(D1_2) Q14.5(D2_1) Q14.6(D2_2) Q19.7(D1_1) Q19.8(D1_2) Q20.5(D2_1) Q20.6(D2_2) SV1.3 SV5.3 SV9.3 SV13.3 TP2.TP TP18.TP TP34.TP TP50.TP U2.3(IN) U3.11(VDC_OUT) U7.3(IN) U8.11(VDC_OUT) U13.3(IN) U14.11(VDC_OUT) U19.3(IN) U20.11(VDC_OUT)
Unconnected: U1.1(PA00) U1.2(PA01) U1.3(PA02) U1.4(PA03) U1.5(PA04) U1.6(PA05) U1.7(PA06) U1.25(PA27) U1.27(PA28) U3.8(GPIO_1) U3.16(D-) U3.17(D+) U3.20(DNU1) U3.21(DNU2) U8.8(GPIO_1) U8.16(D-) U8.17(D+) U8.20(DNU1) U8.21(DNU2) U9.1(PA00) U9.2(PA01) U9.3(PA02) U9.4(PA03) U9.5(PA04) U9.6(PA05) U9.7(PA06) U9.25(PA27) U9.27(PA28) U14.8(GPIO_1) U14.16(D-) U14.17(D+) U14.20(DNU1) U14.21(DNU2) U15.1(PA00) U15.2(PA01) U15.3(PA02) U15.4(PA03) U15.5(PA04) U15.6(PA05) U15.7(PA06) U15.25(PA27) U15.27(PA28) U20.8(GPIO_1) U20.16(D-) U20.17(D+) U20.20(DNU1) U20.21(DNU2) U21.1(PA00) U21.2(PA01) U21.3(PA02) U21.4(PA03) U21.5(PA04) U21.6(PA05) U21.7(PA06) U21.25(PA27) U21.27(PA28)

## Notes on the sheet
- uCONTROLLER
- uCONTROLLER
- uCONTROLLER
- uCONTROLLER

## Library data of the parts
C1-C6 C10 C21-C33 C47-C59 C73-C85 C301-C304 C310 C311 = rcl:C-EU: CAPACITOR, European symbol; SPICEPREFIX: C
D2 D3 D5 D7 = BZV55C12_L0G:BZV55C12_L0G: Check availability <https://pricing.snapeda.com/parts/BZV55C12%20L0G/Taiwan%20Semiconductor%20Corporation/view-part?ref=eda>; AVAILABILITY: In Stock; CHECK_PRICES: https://www.snapeda.com/parts/BZV55C12%20L0G/Taiwan+Semiconductor/view-part/?ref=eda; DESCRIPTION: MMELF, 500mW, 5%, Small Signal Zener Diode; MF: Taiwan Semiconductor Corporation; MP: BZV55C12 L0G; PACKAGE: MINI MELF-2-2 Taiwan Semiconductor; PRICE: None; PURCHASE-URL: https://www.snapeda.com/api/url_track_click_mouser/?unipart_id=6304637&manufacturer=Taiwan Semiconductor Corporation&part_name=BZV55C12 L0G&search_term=None; SNAPEDA_LINK: https://www.snapeda.com/parts/BZV55C12%20L0G/Taiwan+Semiconductor/view-part/?ref=snap
FAULT FAULT2 FAULT4 FAULT6 LED LED2 LED4 LED6 PWR PWR2 PWR4 PWR6 = adafruit:LED: LED OSRAM: - CHIPLED LG R971, LG N971, LY N971, LG Q971, LY Q971, LO R971, LY R971 LH N974, LH R974 LS Q976, LO Q976, LY Q976 LO Q996 - Hyper CHIPLED LW Q18S LB Q993, LB Q99A, LB R99A - SideLED LS A670, LO A670, LY A670, LG A670, LP A670 LB A673, LV A673, LT A673, LW A673 LH A674 LY A675 LS A676, LA A676, LO A676, LY A676, LW A676 LS A679, LY A679, LG A679 - Hyper Micro SIDELED® LS Y876, LA Y876, LO Y876, LY Y876 LT Y87S - SmartLED LW L88C, LW L88S LB L89C, LB L89S, LG L890 LS L89K, LO L89K, LY L89K LS L896, LA L896, LO L896, LY L896 - TOPLED LS T670, LO T670, LY T670, LG T670, LP T670 LSG T670, LSP T670, LSY T670, LOP T670, LYG T670 LG T671, LOG T671, LSG T671 LB T673, LV T673, LT T673, LW T673 LH T674 LS T676, LA T676, LO T676, LY T676, LB T676, LH T676, LSB T676, LW T676 LB T67C, LV T67C, LT T67C, LS T67K, LO T67K, LY T67K, LW E67C LS E67B, LA E67B, LO E67B, LY E67B, LB E67C, LV E67C, LT E67C LW T67C LS T679, LY T679, LG T679 LS T770, LO T770, LY T770, LG T770, LP T770 LB T773, LV T773, LT T773, LW T773 LH T774 LS E675, LA E675, LY E675, LS T675 LS T776, LA T776, LO T776, LY T776, LB T776 LHGB T686 LT T68C, LB T68C - Hyper Mini TOPLED® LB M676 - Mini TOPLED Santana® LG M470 LS M47K, LO M47K, LY M47K Source: http://www.osram.convergy.de/
J2 J4 J5 J7 = USB4105-GF-A:USB4105-GF-A: USB-C (USB TYPE-C) USB 2.0 Receptacle Connector 24 (16+8 Dummy) Position Surface Mount, Right Angle; Through Hole Check availability <https://pricing.snapeda.com/parts/USB4105-GF-A/GCT/view-part?ref=eda>; AVAILABILITY: In Stock; DESCRIPTION: USB-C (USB TYPE-C) USB 2.0 Receptacle Connector 24 (16+8 Dummy) Position Surface Mount, Right Angle; Through Hole; MF: GCT; MP: USB4105-GF-A; PACKAGE: None; PRICE: None; PURCHASE-URL: https://pricing.snapeda.com/search?q=USB4105-GF-A&ref=eda
JTAG JTAG2 JTAG4 JTAG6 = SparkFun-Connectors:CORTEX_DEBUG: Cortex Debug Connector - 10 pin Supports JTAG debug, Serial Wire debug, and Serial Wire Viewer. PTH and SMD connector options available. General Connector Information <http://infocenter.arm.com/help/topic/com.arm.doc.faqs/attached/13634/cortex_debug_connectors.pdf> Products: PTH Connector <http://www.digikey.com/product-detail/en/cnc-tech/3220-10-0100-00/1175-1627-ND/3883661> -via Digi-Key SparkFun PSoc <https://www.sparkfun.com/products/13229> SparkFun T <https://www.sparkfun.com/products/13810>
Q1 Q2 Q7 Q8 Q13 Q14 Q19 Q20 = DMP3098LSD-13:DMP3098LSD-13: MOSFET PMOS-DUAL Source: Datasheet <https://www.diodes.com/assets/Datasheets/ds31448.pdf>; DESCRIPTION: MOSFET PMOS-DUAL; HEIGHT: 1.75mm; MANUFACTURER_NAME: Diodes Inc.; MANUFACTURER_PART_NUMBER: DMP3098LSD-13; MOUSER_PART_NUMBER: 621-DMP3098LSD-13; MOUSER_PRICE-STOCK: https://www.mouser.co.uk/ProductDetail/Diodes-Incorporated/DMP3098LSD-13?qs=oUsD4qhOtFxafARAi3NzqQ%3D%3D
Q3 Q9 Q15 Q21 = 2N7002:2N7002: N-channel MOSFET,2N7002 0.115A 60V Source: Datasheet <https://www.onsemi.com/pub/Collateral/NDS7002A-D.PDF>; DESCRIPTION: N-channel MOSFET,2N7002 0.115A 60V; HEIGHT: 1.2mm; MANUFACTURER_NAME: onsemi; MANUFACTURER_PART_NUMBER: 2N7002; MOUSER_PART_NUMBER: 512-2N7002; MOUSER_PRICE-STOCK: https://www.mouser.co.uk/ProductDetail/onsemi-Fairchild/2N7002?qs=0dwsXDNhqlz66WJJhrTFjQ%3D%3D
R1-R17 R48-R77 R108-R137 R168-R197 R301-R308 R310-R312 R320 R321 = rcl:R-EU_: RESISTOR, European symbol; SPICEPREFIX: R
RESET RESET2 RESET4 RESET6 = SparkFun-Switches:MOMENTARY-SWITCH-SPST: Momentary Switch (Pushbutton) - SPST Normally-open (NO) SPST momentary switches (buttons, pushbuttons). Variants PTH-12MM - 12mm square, through-hole Momentary Pushbutton Switch - 12mm Square <https://www.sparkfun.com/products/9190> (COM-09190) PTH-6.0MM, PTH-6.0MM-KIT - 6.0mm square, through-hole Mini Pushbutton Switch <https://www.sparkfun.com/products/97> (COM-00097) KIT package intended for soldering kit's - only one side of pads' copper is exposed. PTH-RIGHT-ANGLE-KIT - Right-angle, through-hole Right Angle Tactile Button <https://www.sparkfun.com/products/10791> - Used on SparkFun BigTime Watch Kit <https://www.sparkfun.com/products/11734> SMD-12MM - 12mm square, surface-mount Tactile Button - SMD (12mm) <https://www.sparkfun.com/products/12993> (COM-12993) Used on SparkFun PicoBoard <https://www.sparkfun.com/products/11888> SMD-4.5MM - 4.5mm Square Trackball Switch Used on SparkFun Blackberry Trackballer Breakout <https://www.sparkfun.com/products/13169> SMD-4.6MMX2.8MM - 4.60mm x 2.80mm, surface mount Used on SparkFun Pro Micro - RP2040 <https://www.sparkfun.com/products/17717> SMD-5.2MM, SMD-5.2-REDUNDANT - 5.2mm square, surface-mount Mini Pushbutton Switch - SMD <https://www.sparkfun.com/products/8720> (COM-08720) Used on Arduino Pro Mini <https://www.sparkfun.com/products/11114> REDUNDANT package connects both switch circuits together SMD-6.0X3.5MM - 6.0 x 3.5mm, surface mount Momentary Reset Switch SMD <https://www.sparkfun.com/products/8229> (COM-08229) SMD-6.2MM-TALL - 6.2mm square, surface mount Tactile Button - SMD (6mm) <https://www.sparkfun.com/products/12992> Used on SparkFun Digital Sandbox <https://www.sparkfun.com/products/12651> SMD-RIGHT-ANGLE - Right-angle, surface mount Used on SparkFun Block for Intel® Edison - Arduino <https://www.sparkfun.com/products/13036>; PROD_ID: SWCH-14278; SF_SKU: COM-08229
SV1 SV5 SV9 SV13 = con-lstb_round_pads:MA04-1: PIN HEADER; OC_FARNELL: unknown; OC_NEWARK: unknown
SV2 SV6 SV10 SV14 = con-lstb_round_pads:MA05-2: PIN HEADER; OC_FARNELL: unknown; OC_NEWARK: unknown
TP1-TP8 TP17-TP24 TP33-TP40 TP49-TP56 = testpad:TP: Test pad
U1 U9 U15 U21 = SAMD21E18:ATSAMD21E18A-AU; COPYRIGHT: Copyright (C) 2022 Ultra Librarian. All rights reserved.; MANUFACTURER_PART_NUMBER: ATSAMD21E18A-AU; MFR_NAME: Microchip
U2 U7 U13 U19 = SparkFun-IC-Power:V_REG_LM1117: Voltage Regulator LM1117 Standard adjustable voltage regulator but in SMD form. Spark Fun Electronics SKU : COM-00595; PROD_ID: VREG-08170
U3 U8 U14 U20 = CYPD3177-24LQXQT:CYPD3177-24LQXQT: USB Type-C DFP Port Controller USB 1.1 3.3V/5V T/R 24-Pin QFN EP Source: Datasheet <https://www.cypress.com/file/460416/download>; DESCRIPTION: USB Type-C DFP Port Controller USB 1.1 3.3V/5V T/R 24-Pin QFN EP; HEIGHT: 0.6mm; MANUFACTURER_NAME: Cypress Semiconductor; MANUFACTURER_PART_NUMBER: CYPD3177-24LQXQT; MOUSER_PART_NUMBER: 727-CYPD3177-24LQXQT; MOUSER_PRICE-STOCK: https://www.mouser.co.uk/ProductDetail/Cypress-Semiconductor/CYPD3177-24LQXQT?qs=PzGy0jfpSMvUfBLYWBYBLA%3D%3D

## Net classes
1 usbpair: width 0.25 mm, clearance 0.2 mm